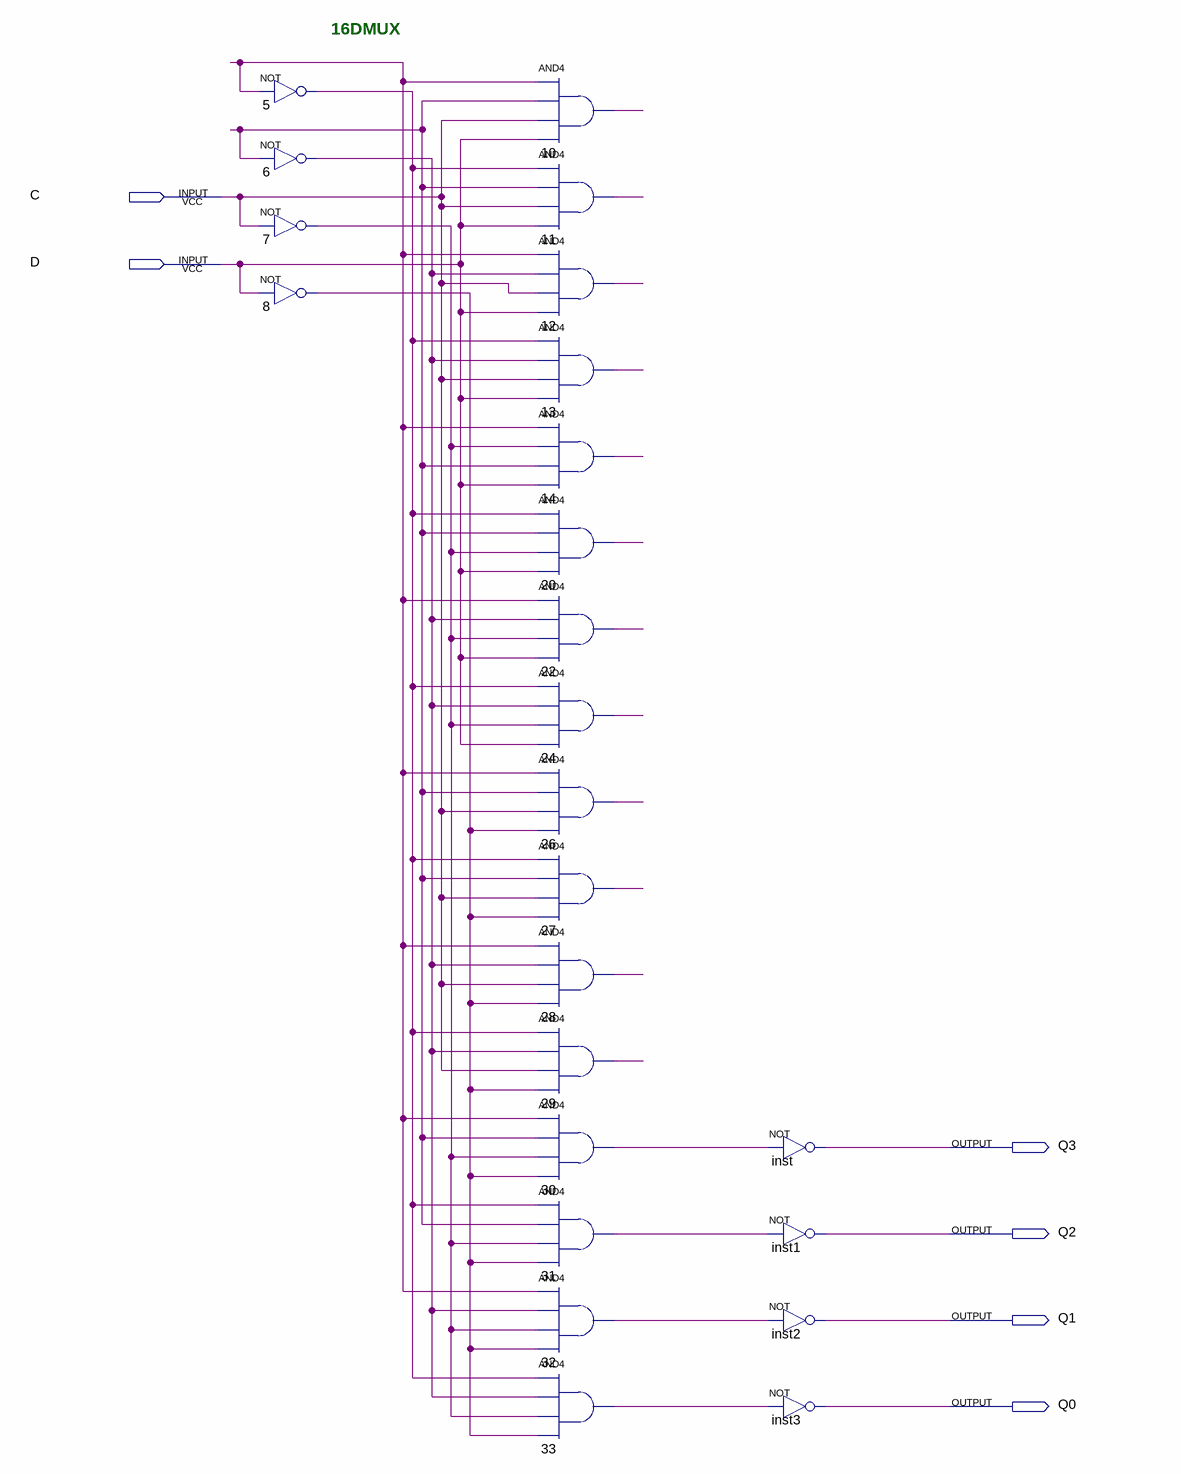
[diagram p0: schematic sheet]
// Quartus schematic 4OutDMux.bdf as structural Verilog: 24 symbols, 6 pins
module \4OutDMux  (
  input  C,
  input  D,
  output Q3,
  output Q2,
  output Q1,
  output Q0
);

  wire n5_out, n6_out, n7_out, n8_out, n10_out, n11_out, n12_out, n13_out, n14_out, n20_out, n22_out,
       n24_out, n26_out, n27_out, n28_out, n29_out, n30_out, n31_out, n32_out, n33_out, undriven, undriven_2;

  not u_5 (n5_out, undriven);
  not u_6 (n6_out, undriven_2);
  not u_7 (n7_out, C);
  not u_8 (n8_out, D);
  and u_10 (n10_out, undriven, undriven_2, C, D);
  and u_11 (n11_out, n5_out, undriven_2, C, D);
  and u_12 (n12_out, undriven, n6_out, C, D);
  and u_13 (n13_out, n5_out, n6_out, C, D);
  and u_14 (n14_out, undriven, n7_out, undriven_2, D);
  and u_20 (n20_out, n5_out, undriven_2, n7_out, D);
  and u_22 (n22_out, undriven, n6_out, n7_out, D);
  and u_24 (n24_out, n5_out, n6_out, n7_out, D);
  and u_26 (n26_out, undriven, undriven_2, C, n8_out);
  and u_27 (n27_out, n5_out, undriven_2, C, n8_out);
  and u_28 (n28_out, undriven, n6_out, C, n8_out);
  and u_29 (n29_out, n5_out, n6_out, C, n8_out);
  and u_30 (n30_out, undriven, undriven_2, n7_out, n8_out);
  and u_31 (n31_out, n5_out, undriven_2, n7_out, n8_out);
  and u_32 (n32_out, undriven, n6_out, n7_out, n8_out);
  and u_33 (n33_out, n5_out, n6_out, n7_out, n8_out);
  not inst (Q3, n30_out);
  not inst1 (Q2, n31_out);
  not inst2 (Q1, n32_out);
  not inst3 (Q0, n33_out);

  // Notes on the sheet:
  //   16DMUX
endmodule
